# Altium schematic sheet MAZ000161 - Diagrama eléctrico.SchDoc: MAZ000161 - Diagrama eléctrico
size A; ApprovedBy: Christian Ledwidth; CheckedBy: Nahuel Martinez; Author: Santiago Marti; CompanyName: Body Health; DrawnBy: Santiago Marti; Revision: A; SheetNumber: 1; SheetTotal: 2
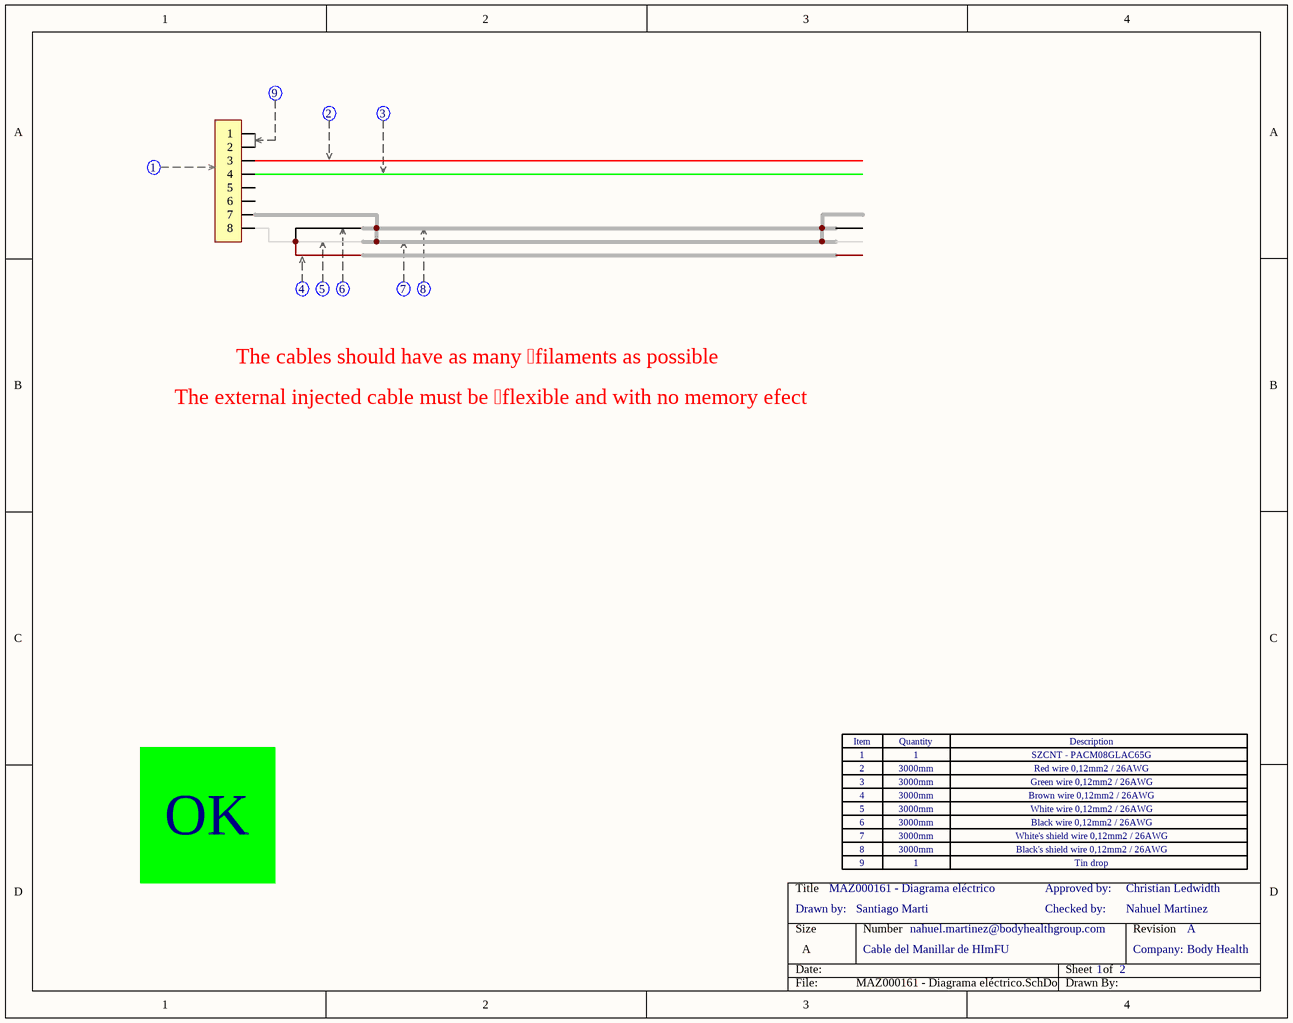
[diagram p0: MAZ000161 - Diagrama eléctrico.SchDoc]

## Parts
(Parts that share a designator on the sheet are numbered #1, #2 ... from top to bottom, then left to right.)
Conn1  SZCNT_08_Macho  (value not drawn)  (part C of 3)
Conn2  SZCNT_08_Macho  (value not drawn)  (part B of 3)
Conn3  SZCNT_08_Macho  (value not drawn)  (part B of 3)
Conn6  SZCNT_08_Macho  (value not drawn)  (part B of 3)
Conn9  SZCNT_08_Macho  (value not drawn)  (part B of 3)
Conn?#1  SZCNT_08_Macho  (value not drawn)  (part B of 3)
Conn?#2  SZCNT_08_Macho  (value not drawn)  (part B of 3)
Conn?#3  SZCNT_08_Macho  (value not drawn)  (part B of 3)
Conn?#4  SZCNT_08_Macho  (value not drawn)  (part B of 3)
Conn?#5  SZCNT_08_Macho  (value not drawn)  (part B of 3)
Zoc1  Zócalo_Header  (value not drawn)
Zoc2  Zócalo_Item  (value not drawn)
Zoc3  Zócalo_Item  (value not drawn)
Zoc4  Zócalo_Item  (value not drawn)
Zoc5  Zócalo_Item  (value not drawn)
Zoc6  Zócalo_Item  (value not drawn)
Zoc7  Zócalo_Item  (value not drawn)
Zoc8  Zócalo_Item  (value not drawn)
Zoc9  Zócalo_Item  (value not drawn)
Zoc?  Zócalo_Item  (value not drawn)

## Nets
NetConn1_1: Conn1.1 Conn1.2
NetConn1_7: Conn1.7 Conn1.8

Not connected (* = marked no-connect by the designer): Conn1 3 4 5 6

## Notes on the sheet
- The cables should have as many filaments as possible
- The external injected cable must be flexible and with no memory efect
- 1
- 2
- 3
- 3000mm
- SZCNT - PACM08GLAC65G
- Red wire 0,12mm2 / 26AWG
- Green wire 0,12mm2 / 26AWG
- OK
- 4
- 5
- 6
- 7
- Brown wire 0,12mm2 / 26AWG
- White wire 0,12mm2 / 26AWG
- Black wire 0,12mm2 / 26AWG
- White's shield wire 0,12mm2 / 26AWG
- Drawn by:
- 8
- 9
- Checked by:
- Approved by:
- Black's shield wire 0,12mm2 / 26AWG
- Tin drop
- Cable del Manillar de HImFU
- nahuel.martinez@bodyhealthgroup.com
- Company:
- (in symbol Zócalo_Header) Item; Quantity; Description

## Library data of the parts
Conn1 = SZCNT_08_Macho: Conector SZCNT 8 vías macho para cable; Cod.DigiKey: Se compra a SZCNT; Cod.Fabricante: *; ComponentLink1Description: Manufacturer Link; ComponentLink1URL: *; DIGIKEYx100: *; Fabricante: SZCNT; CallOut: *; DIGIKEYx50: *
Conn2 = SZCNT_08_Macho: Conector SZCNT 8 vías macho para cable; CallOut: 2; Cod.DigiKey: Se compra a SZCNT; Cod.Fabricante: *; ComponentLink1Description: Manufacturer Link; ComponentLink1URL: *; DIGIKEYx100: *; Fabricante: SZCNT; DIGIKEYx50: *
Conn3 = SZCNT_08_Macho: Conector SZCNT 8 vías macho para cable; CallOut: 3; Cod.DigiKey: Se compra a SZCNT; Cod.Fabricante: *; ComponentLink1Description: Manufacturer Link; ComponentLink1URL: *; DIGIKEYx100: *; Fabricante: SZCNT; DIGIKEYx50: *
Conn6 = SZCNT_08_Macho: Conector SZCNT 8 vías macho para cable; CallOut: 4; Cod.DigiKey: Se compra a SZCNT; Cod.Fabricante: *; ComponentLink1Description: Manufacturer Link; ComponentLink1URL: *; DIGIKEYx100: *; Fabricante: SZCNT; DIGIKEYx50: *
Conn9 = SZCNT_08_Macho: Conector SZCNT 8 vías macho para cable; CallOut: 1; Cod.DigiKey: Se compra a SZCNT; Cod.Fabricante: *; ComponentLink1Description: Manufacturer Link; ComponentLink1URL: *; DIGIKEYx100: *; Fabricante: SZCNT; DIGIKEYx50: *
Conn?#1 = SZCNT_08_Macho: Conector SZCNT 8 vías macho para cable; CallOut: 9; Cod.DigiKey: Se compra a SZCNT; Cod.Fabricante: *; ComponentLink1Description: Manufacturer Link; ComponentLink1URL: *; DIGIKEYx100: *; Fabricante: SZCNT; DIGIKEYx50: *
Conn?#2 = SZCNT_08_Macho: Conector SZCNT 8 vías macho para cable; CallOut: 5; Cod.DigiKey: Se compra a SZCNT; Cod.Fabricante: *; ComponentLink1Description: Manufacturer Link; ComponentLink1URL: *; DIGIKEYx100: *; Fabricante: SZCNT; DIGIKEYx50: *
Conn?#3 = SZCNT_08_Macho: Conector SZCNT 8 vías macho para cable; CallOut: 6; Cod.DigiKey: Se compra a SZCNT; Cod.Fabricante: *; ComponentLink1Description: Manufacturer Link; ComponentLink1URL: *; DIGIKEYx100: *; Fabricante: SZCNT; DIGIKEYx50: *
Conn?#4 = SZCNT_08_Macho: Conector SZCNT 8 vías macho para cable; CallOut: 7; Cod.DigiKey: Se compra a SZCNT; Cod.Fabricante: *; ComponentLink1Description: Manufacturer Link; ComponentLink1URL: *; DIGIKEYx100: *; Fabricante: SZCNT; DIGIKEYx50: *
Conn?#5 = SZCNT_08_Macho: Conector SZCNT 8 vías macho para cable; CallOut: 8; Cod.DigiKey: Se compra a SZCNT; Cod.Fabricante: *; ComponentLink1Description: Manufacturer Link; ComponentLink1URL: *; DIGIKEYx100: *; Fabricante: SZCNT; DIGIKEYx50: *
Zoc1 = Zócalo_Header: Header para el zócalo de referencias
Zoc2-Zoc9 Zoc? = Zócalo_Item: Ítem para el zócalo de referencias; Desginator: *; Quantity: *; ItemDescription: *